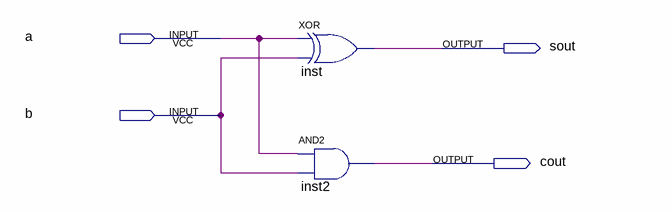
[diagram p0: schematic sheet]
// Quartus schematic adder.bdf as structural Verilog: 2 symbols, 4 pins
module adder (
  input  a,
  input  b,
  output sout,
  output cout
);

  xor inst (sout, a, b);
  and inst2 (cout, a, b);
endmodule
